# EAGLE design TimePassThrough (EAGLE 7.2.0)
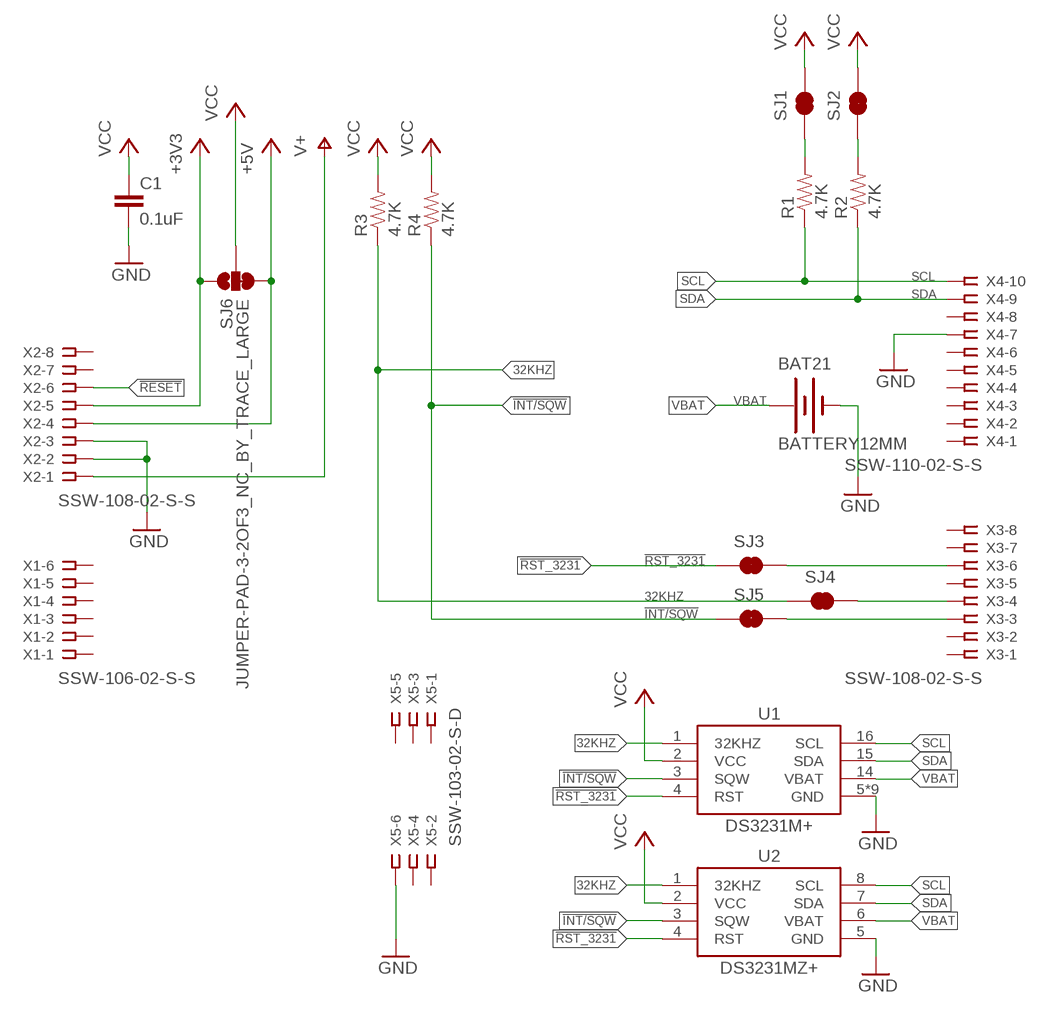
[diagram p0: schematic, sheet 1]

## Parts
BAT21  BATTERY12MM  [BATTCON_12MM]
C1  0.1uF  CAP0805  [0805]
R1  4.7K  RESISTOR0805-RES  [0805]
R2  4.7K  RESISTOR0805-RES  [0805]
R3  4.7K  RESISTOR0805-RES  [0805]
R4  4.7K  RESISTOR0805-RES  [0805]
SJ1  JUMPER-PAD-2-NC_BY_TRACE  [PAD-JUMPER-2-NC_BY_TRACE_YES_SILK]
SJ2  JUMPER-PAD-2-NC_BY_TRACE  [PAD-JUMPER-2-NC_BY_TRACE_YES_SILK]
SJ3  JUMPER-PAD-2-NC_BY_TRACE  [PAD-JUMPER-2-NC_BY_TRACE_YES_SILK]
SJ4  JUMPER-PAD-2-NC_BY_TRACE  [PAD-JUMPER-2-NC_BY_TRACE_YES_SILK]
SJ5  JUMPER-PAD-2-NC_BY_TRACE  [PAD-JUMPER-2-NC_BY_TRACE_YES_SILK]
SJ6  JUMPER-PAD-3-2OF3_NC_BY_TRACE_LARGE  [PAD-JUMPER-3-2OF3_NC_BY_TRACE_YES_SILK_LARGE]
U1  DS3231M+  [W16MK+1]
U2  DS3231MZ+  [S8MK+1]
X1  SSW-106-02-S-S  [SSW-106-02-S-S]
X2  SSW-108-02-S-S  [SSW-108-02-S-S]
X3  SSW-108-02-S-S  [SSW-108-02-S-S]
X4  SSW-110-02-S-S  [SSW-110-02-S-S]
X5  SSW-103-02-S-D  [SSW-103-02-S-D]

## Nets
32KHZ: R3.1 SJ4.1 U1.1(32KHZ) U2.1(32KHZ)
!INT/SQW: R4.1 SJ5.1 U1.3(SQW) U2.3(SQW)
!RESET: X2.6
!RST_3231: SJ3.1 U1.4(RST) U2.4(RST)
+3V3 [usbvcc]: SJ6.1 X2.5
+5V [usbvcc]: SJ6.3 X2.4
GND [ground]: BAT21.GND(-) C1.2 U1.5(GND) U1.6(GND) U1.7(GND) U1.8(GND) U1.9(GND) U1.10(GND) U1.11(GND) U1.12(GND) U1.13(GND) U2.5(GND) X2.2 X2.3 X4.7 X5.6
N$1: SJ3.2 X3.6
N$2: SJ4.2 X3.4
N$3: SJ5.2 X3.3
N$4: R1.2 SJ1.1
N$5: R2.2 SJ2.1
SCL: R1.1 U1.16(SCL) U2.8(SCL) X4.10
SDA: R2.1 U1.15(SDA) U2.7(SDA) X4.9
V+ [power]: X2.1
VBAT [power]: BAT21.PWR@1(+) BAT21.PWR@2(+) U1.14(VBAT) U2.6(VBAT)
VCC [power]: C1.1 R3.2 R4.2 SJ1.2 SJ2.2 SJ6.2 U1.2(VCC) U2.2(VCC)
Unconnected: X1.1 X1.2 X1.3 X1.4 X1.5 X1.6 X2.7 X2.8 X3.1 X3.2 X3.5 X3.7 X3.8 X4.1 X4.2 X4.3 X4.4 X4.5 X4.6 X4.8 X5.1 X5.2 X5.3 X5.4 X5.5

## Library data of the parts
BAT21 = TimePassThrough:BATTERY: Battery Holders Various common sizes : AA, AAA, 18650 (PRT-12895), 20mm coin cell and 12mm coin cell. 20MM_4LEGS, BATT-10373; PROD_ID: BATT-08044
C1 = SparkFun-Capacitors:CAP: Capacitor Standard 0603 ceramic capacitor, and 0.1" leaded capacitor.
R1-R4 = SparkFun-Resistors:RESISTOR: Resistor Basic schematic elements and footprints for 0603, 1206, and PTH resistors.
SJ1-SJ5 = SparkFun-Passives:JUMPER-PAD-2-NC_BY_TRACE
SJ6 = SparkFun-Passives:JUMPER-PAD-3-2OF3_NC_BY_TRACE
U1 = TimePassThrough:DS3231M: DS3231M Real Time Clock. Accuracy +/-5ppm. Battery Backup. 2.3V to 5.5V.
U2 = TimePassThrough:DS3231M: DS3231M Real Time Clock. Accuracy +/-5ppm. Battery Backup. 2.3V to 5.5V.; PROD_ID: IC-11985
X1 = TimePassThrough:SSW-106-02-S-S: THROUGH-HOLE .025" SQ POST SOCKET Source: Samtec SSW.pdf; MPN: SSW-106-02-S-S; OC_FARNELL: unknown; OC_NEWARK: 11P9416
X2 X3 = TimePassThrough:SSW-108-02-S-S: THROUGH-HOLE .025" SQ POST SOCKET Source: Samtec SSW.pdf; MPN: SSW-108-02-S-S; OC_FARNELL: unknown; OC_NEWARK: 11P9448
X4 = TimePassThrough:SSW-110-02-S-S: THROUGH-HOLE .025" SQ POST SOCKET Source: Samtec SSW.pdf; MPN: SSW-110-02-S-S; OC_FARNELL: unknown; OC_NEWARK: 11P9482
X5 = TimePassThrough:SSW-103-02-S-D: THROUGH-HOLE .025" SQ POST SOCKET Source: Samtec SSW.pdf; MPN: SSW-103-02-S-D; OC_FARNELL: unknown; OC_NEWARK: 11P9365

## Net classes
0 default: width 0.254 mm, clearance 0.254 mm
1 power: width 0.61 mm, drill 0.61 mm, clearance 0.254 mm
2 ground: width 0.305 mm, drill 0.559 mm, clearance 0.254 mm
3 usbvcc: width 0.508 mm, drill 0.61 mm, clearance 0.254 mm
4 aref: width 0.406 mm, drill 0.61 mm, clearance 0.254 mm

## Board
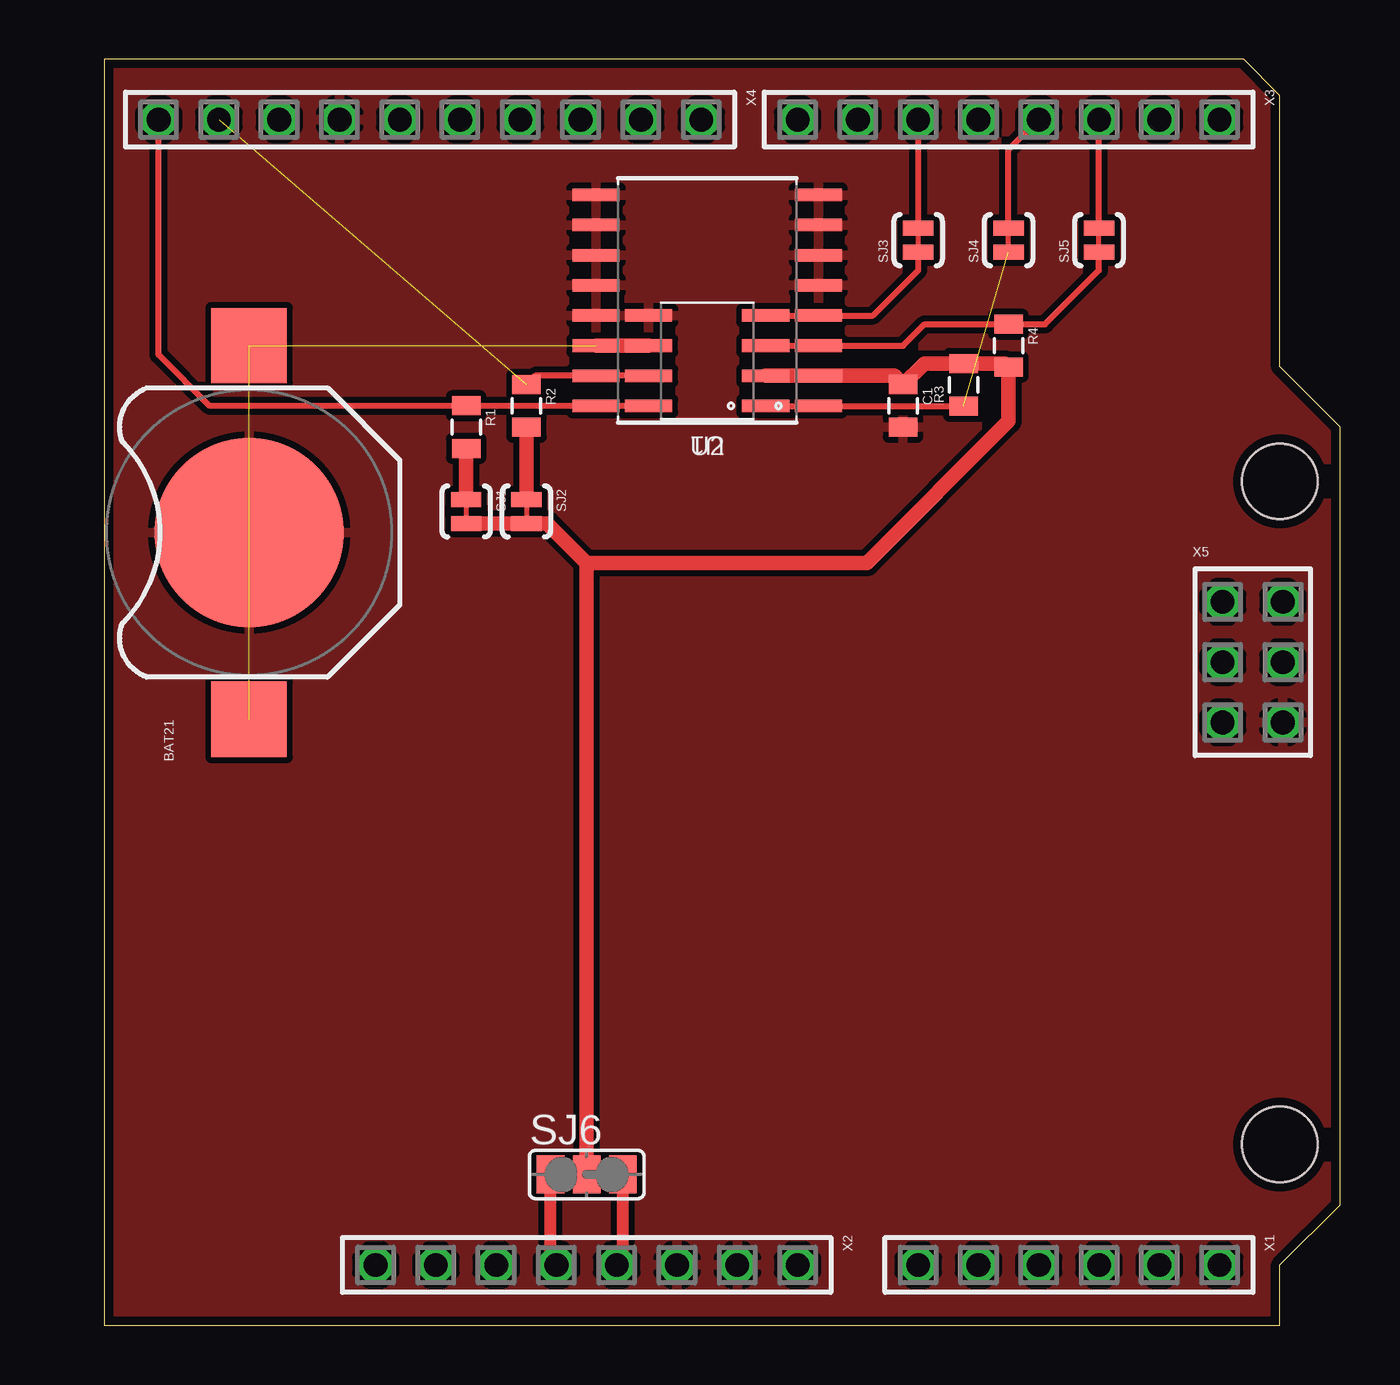
[diagram p1: board, top side]

Size 52.07 x 53.34 mm. Coordinates in mm from the lower left corner, seen from the top.
Outline: 0,0 49.53,0 49.53,2.54 52.07,5.08 52.07,37.85 49.53,40.39 49.53,51.82 48.01,53.34 0,53.34 0,0
Copper layers (1*16): Top 0.0356mm / dielectric 1.5011mm / Bottom 0.0356mm
Design rules "oshpark-2layer": minimum track width 6mil, minimum drill 13mil, track to track 6mil, track to pad 6mil, pad to pad 6mil, via to via 6mil, smd to smd 6mil, copper to edge 15mil, drill to drill 6mil, minimum pad ring 7mil, minimum via ring 7mil, stop-mask expansion 4mil, vias tented up to drill 0mil, thermal gap 10mil
Holes 3.17 mm at 49.53,35.56 49.53,7.62

### Footprints (pad centres in the part's own frame; a part is rotated, then mirrored left to right if it is on the bottom)
BATTCON_12MM = smd 8 x 8: GND 0,0 | smd 3.175 x 3.175: PWR@1 -7.874,0; PWR@2 7.874,0
0805 = smd 0.8 x 1.2: 1 -0.9,0; 2 0.9,0
PAD-JUMPER-2-NC_BY_TRACE_YES_SILK = smd 0.635 x 1.27: 1 -0.508,0; 2 0.508,0
PAD-JUMPER-3-2OF3_NC_BY_TRACE_YES_SILK_LARGE = smd 1.168 x 1.6: 1 -1.524,0; 2 0,0; 3 1.524,0
W16MK+1 = smd 1.98 x 0.53: 1 -4.685,4.445; 2 -4.685,3.175; 3 -4.685,1.905; 4 -4.685,0.635; 5 -4.685,-0.635; 6 -4.685,-1.905; 7 -4.685,-3.175; 8 -4.685,-4.445; 9 4.685,-4.445; 10 4.685,-3.175; 11 4.685,-1.905; 12 4.685,-0.635; 13 4.685,0.635; 14 4.685,1.905; 15 4.685,3.175; 16 4.685,4.445
S8MK+1 = smd 1.98 x 0.53: 1 -2.465,1.905; 2 -2.465,0.635; 3 -2.465,-0.635; 4 -2.465,-1.905; 5 2.465,-1.905; 6 2.465,-0.635; 7 2.465,0.635; 8 2.465,1.905
SSW-106-02-S-S = drill 1 pad 1.5 octagon: 1 -6.35,0; 2 -3.81,0; 3 -1.27,0; 4 1.27,0; 5 3.81,0; 6 6.35,0
SSW-108-02-S-S = drill 1 pad 1.5 octagon: 1 -8.89,0; 2 -6.35,0; 3 -3.81,0; 4 -1.27,0; 5 1.27,0; 6 3.81,0; 7 6.35,0; 8 8.89,0
SSW-110-02-S-S = drill 1 pad 1.5 octagon: 1 -11.43,0; 2 -8.89,0; 3 -6.35,0; 4 -3.81,0; 5 -1.27,0; 6 1.27,0; 7 3.81,0; 8 6.35,0; 9 8.89,0; 10 11.43,0
SSW-103-02-S-D = drill 1 pad 1.5 octagon: 1 -2.54,-1.27; 2 -2.54,1.27; 3 0,-1.27; 4 0,1.27; 5 2.54,-1.27; 6 2.54,1.27

### Placement (x,y rotation side)
BAT21  6.1,33.4 90 top
C1  33.66,38.73 270 top
R1  15.24,37.85 270 top
R2  17.78,38.73 270 top
R3  36.2,39.62 90 top
R4  38.1,41.27 270 top
SJ1  15.24,34.29 270 top
SJ2  17.78,34.29 270 top
SJ3  34.29,45.72 90 top
SJ4  38.1,45.72 90 top
SJ5  41.91,45.72 90 top
SJ6  20.32,6.35 0 top
U1  25.4,43.18 180 top
U2  25.4,40.64 180 top
X1  40.64,2.54 180 top
X2  20.32,2.54 180 top
X3  38.1,50.8 180 top
X4  13.72,50.8 180 top
X5  48.39,27.94 270 top

### Tracks (layer width: path | path; a pad name or v marks a point on that pad's centre or on a via)
32KHZ  (1 unrouted)
  Top 0.254: U2.1 U1.1 30.1,38.72 R3.1
!INT/SQW
  Top 0.254: U2.3 U1.3 33.66,41.27 34.55,42.17 R4.1 39.63,42.17 41.91,44.45 SJ5.1
!RST_3231
  Top 0.254: U2.4 U1.4 32.38,42.55 34.29,44.45 SJ3.1
+3V3
  Top 0.508: X2.5 18.8,2.79 SJ6.1
+5V
  Top 0.508: X2.4 21.84,2.79 SJ6.3
GND
  pour Top: 0,0 49.53,0 49.53,2.54 52.07,5.08 52.07,37.85 49.53,40.39 49.53,51.82 48.01,53.34 0,53.34
N$1
  Top 0.254: SJ3.2 X3.6
N$2
  Top 0.254: SJ4.2 38.1,49.53 X3.4
N$3
  Top 0.254: SJ5.2 X3.3
N$4
  Top 0.61: R1.2 SJ1.1
N$5
  Top 0.61: SJ2.1 R2.2
SCL
  Top 0.254: U2.8 U1.16 15.25,38.73 | 15.25,38.73 R1.1 | 15.25,38.73 4.45,38.73 2.29,40.89 X4.10
SDA  (1 unrouted)
  Top 0.254: U2.7 U1.15 18.15,40.01 R2.1
VBAT  (2 unrouted)
  Top 0.61: U2.6 U1.14
VCC
  Top 0.61: U2.2 U1.2 33.28,40.01 C1.1 34.54,40.52 R3.2 37.95,40.52 R4.2 38.1,38.1 32.12,32.12 20.32,32.12 | SJ6.2 20.32,32.12 | SJ1.2 SJ2.2 18.66,33.78 20.32,32.12